# Altium schematic sheet ADC.SchDoc
size Tabloid; DrawnBy: V-P.Rheaume@USherbrooke.ca; Organization: Universite de Sherbrooke; Address1: L3, 12a Rodborough Rd; Address2: Frenchs Forest; Address3: NSW; Address4: Australia 2086; Revision: 0; SheetNumber: 6; SheetTotal: 8; SheetName: ADC
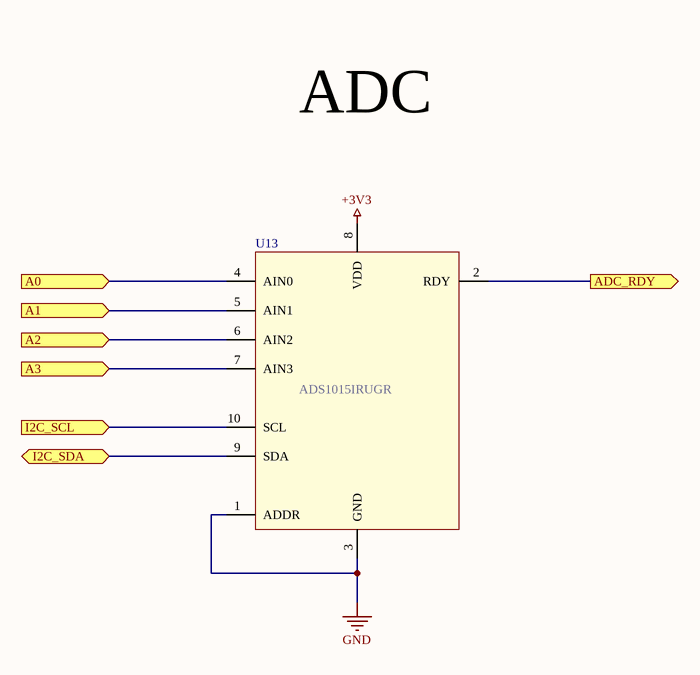
[diagram p0: ADC.SchDoc]

## Parts
U13  ADS1015IRUGR  [ADS1018IRUGR]

## Ports
A0 (in), A1 (in), A2 (in), A3 (in), ADC_RDY (out), I2C_SCL (in), I2C_SDA (bidir)

## Nets
+3V3: U13.8(VDD)
GND: U13.1(ADDR) U13.3(GND)
A0: U13.4(AIN0) ; port A0
A1: U13.5(AIN1) ; port A1
A2: U13.6(AIN2) ; port A2
A3: U13.7(AIN3) ; port A3
ADC_RDY: U13.2(RDY) ; port ADC_RDY
I2C_SCL: U13.10(SCL) ; port I2C_SCL
I2C_SDA: U13.9(SDA) ; port I2C_SDA

## Notes on the sheet
- ADC
- Sheet name
- Project name
- Contact
- Rev
- Date
- Sheet
- of

## Library data of the parts
U13 = ADS1115: 16-bit ADC, 4-channel; Mfg: TI; HelpURL: http://www.ti.com/lit/ds/symlink/ads1113.pdf; Mfg_PN: ADS1015IRUGR; NI: *; Supplier1: Digikey; Supplier1_PN: 296-43557-1-ND; Type: *